# Altium schematic sheet SC942C_ETOR2.SchDoc: Entrées TOR 2/2
size 393 x 270 mm; CompanyName: Seccom; Address1: 521, rue du capt. François Garbit; Address2: 69440 Mornant; Address3: seccom@seccom.fr; Address4: www.seccom.fr; DocumentNumber: 4; SheetNumber: 4; SheetTotal: 8; PageSetup: Record=PageOptions|CenterHorizontal=True|CenterVertical=True|PrintScale=0.74|XCorrection=1.00|YCorrection=1.00|PrintKind=0|BorderSize=5000000|LeftOffset=0|BottomOffset=0|Orientation=2|PaperLength=1000|PaperWidth=1000|Scale=100|PaperSource=7|PrintQuality=-4|MediaType=1|DitherType=10|PaperKind=A4|PrintScaleMode=1
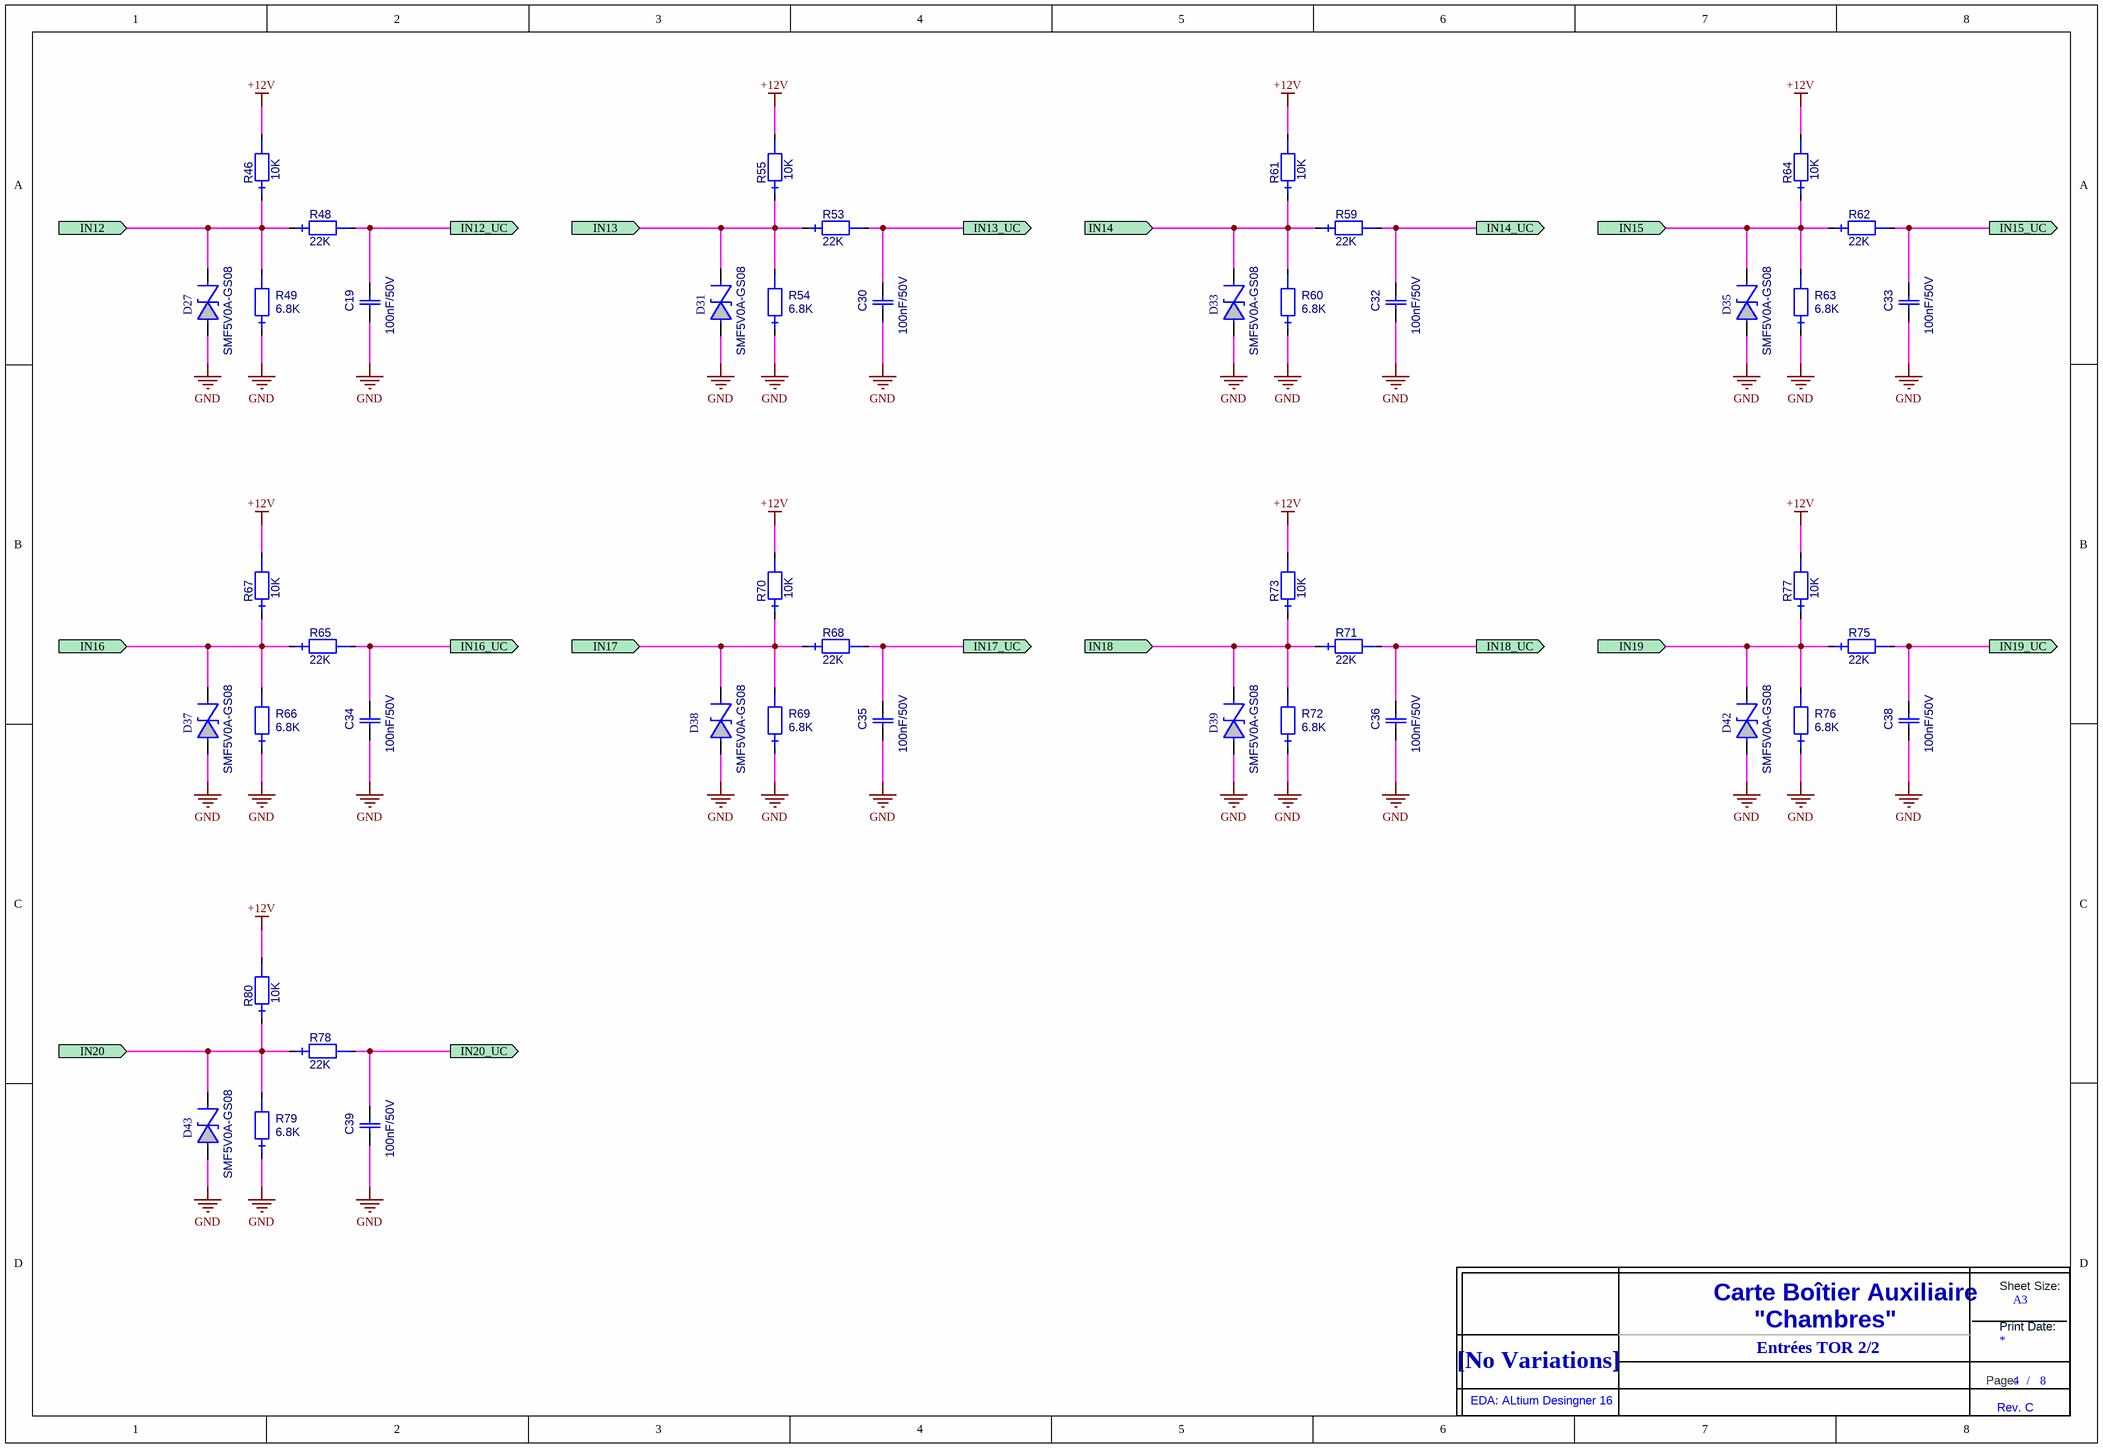
[diagram p0: SC942C_ETOR2.SchDoc]

## Parts
C19  value 100nF/50V  [0805_ReflowSoldering_CAP]  (hidden comment: C_0805_X7R_10%_100N-50V)
C30  value 100nF/50V  [0805_ReflowSoldering_CAP]  (hidden comment: C_0805_X7R_10%_100N-50V)
C32  value 100nF/50V  [0805_ReflowSoldering_CAP]  (hidden comment: C_0805_X7R_10%_100N-50V)
C33  value 100nF/50V  [0805_ReflowSoldering_CAP]  (hidden comment: C_0805_X7R_10%_100N-50V)
C34  value 100nF/50V  [0805_ReflowSoldering_CAP]  (hidden comment: C_0805_X7R_10%_100N-50V)
C35  value 100nF/50V  [0805_ReflowSoldering_CAP]  (hidden comment: C_0805_X7R_10%_100N-50V)
C36  value 100nF/50V  [0805_ReflowSoldering_CAP]  (hidden comment: C_0805_X7R_10%_100N-50V)
C38  value 100nF/50V  [0805_ReflowSoldering_CAP]  (hidden comment: C_0805_X7R_10%_100N-50V)
C39  value 100nF/50V  [0805_ReflowSoldering_CAP]  (hidden comment: C_0805_X7R_10%_100N-50V)
D27  SMF5V0A-GS08  [DO219AB-SMF-P_ReflowSoldering]
D31  SMF5V0A-GS08  [DO219AB-SMF-P_ReflowSoldering]
D33  SMF5V0A-GS08  [DO219AB-SMF-P_ReflowSoldering]
D35  SMF5V0A-GS08  [DO219AB-SMF-P_ReflowSoldering]
D37  SMF5V0A-GS08  [DO219AB-SMF-P_ReflowSoldering]
D38  SMF5V0A-GS08  [DO219AB-SMF-P_ReflowSoldering]
D39  SMF5V0A-GS08  [DO219AB-SMF-P_ReflowSoldering]
D42  SMF5V0A-GS08  [DO219AB-SMF-P_ReflowSoldering]
D43  SMF5V0A-GS08  [DO219AB-SMF-P_ReflowSoldering]
R46  value 10K  [0805_ReflowSoldering_RES]  (hidden comment: RES_0805_1%_100PPM_10K)
R48  value 22K  [0805_ReflowSoldering_RES]  (hidden comment: RES_0805_1%_100PPM_22K)
R49  value 6.8K  [0805_ReflowSoldering_RES]  (hidden comment: RES_0805_1%_100PPM_6.8K)
R53  value 22K  [0805_ReflowSoldering_RES]  (hidden comment: RES_0805_1%_100PPM_22K)
R54  value 6.8K  [0805_ReflowSoldering_RES]  (hidden comment: RES_0805_1%_100PPM_6.8K)
R55  value 10K  [0805_ReflowSoldering_RES]  (hidden comment: RES_0805_1%_100PPM_10K)
R59  value 22K  [0805_ReflowSoldering_RES]  (hidden comment: RES_0805_1%_100PPM_22K)
R60  value 6.8K  [0805_ReflowSoldering_RES]  (hidden comment: RES_0805_1%_100PPM_6.8K)
R61  value 10K  [0805_ReflowSoldering_RES]  (hidden comment: RES_0805_1%_100PPM_10K)
R62  value 22K  [0805_ReflowSoldering_RES]  (hidden comment: RES_0805_1%_100PPM_22K)
R63  value 6.8K  [0805_ReflowSoldering_RES]  (hidden comment: RES_0805_1%_100PPM_6.8K)
R64  value 10K  [0805_ReflowSoldering_RES]  (hidden comment: RES_0805_1%_100PPM_10K)
R65  value 22K  [0805_ReflowSoldering_RES]  (hidden comment: RES_0805_1%_100PPM_22K)
R66  value 6.8K  [0805_ReflowSoldering_RES]  (hidden comment: RES_0805_1%_100PPM_6.8K)
R67  value 10K  [0805_ReflowSoldering_RES]  (hidden comment: RES_0805_1%_100PPM_10K)
R68  value 22K  [0805_ReflowSoldering_RES]  (hidden comment: RES_0805_1%_100PPM_22K)
R69  value 6.8K  [0805_ReflowSoldering_RES]  (hidden comment: RES_0805_1%_100PPM_6.8K)
R70  value 10K  [0805_ReflowSoldering_RES]  (hidden comment: RES_0805_1%_100PPM_10K)
R71  value 22K  [0805_ReflowSoldering_RES]  (hidden comment: RES_0805_1%_100PPM_22K)
R72  value 6.8K  [0805_ReflowSoldering_RES]  (hidden comment: RES_0805_1%_100PPM_6.8K)
R73  value 10K  [0805_ReflowSoldering_RES]  (hidden comment: RES_0805_1%_100PPM_10K)
R75  value 22K  [0805_ReflowSoldering_RES]  (hidden comment: RES_0805_1%_100PPM_22K)
R76  value 6.8K  [0805_ReflowSoldering_RES]  (hidden comment: RES_0805_1%_100PPM_6.8K)
R77  value 10K  [0805_ReflowSoldering_RES]  (hidden comment: RES_0805_1%_100PPM_10K)
R78  value 22K  [0805_ReflowSoldering_RES]  (hidden comment: RES_0805_1%_100PPM_22K)
R79  value 6.8K  [0805_ReflowSoldering_RES]  (hidden comment: RES_0805_1%_100PPM_6.8K)
R80  value 10K  [0805_ReflowSoldering_RES]  (hidden comment: RES_0805_1%_100PPM_10K)
Title_new?  DNI  (value not drawn)  (graphical)

## Ports
IN12 (in), IN12_UC (out), IN13 (in), IN13_UC (out), IN14 (in), IN14_UC (out), IN15 (in), IN15_UC (out), IN16 (in), IN16_UC (out), IN17 (in), IN17_UC (out), IN18 (in), IN18_UC (out), IN19 (in), IN19_UC (out), IN20 (in), IN20_UC (out)

## Nets
+12V: R46.2 R55.2 R61.2 R64.2 R67.2 R70.2 R73.2 R77.2 R80.2
GND: C19.1 C30.1 C32.1 C33.1 C34.1 C35.1 C36.1 C38.1 C39.1 D27.A D31.A D33.A D35.A D37.A D38.A D39.A D42.A D43.A R49.1 R54.1 R60.1 R63.1 R66.1 R69.1 R72.1 R76.1 R79.1
IN12: D27.K R46.1 R48.1 R49.2 ; port IN12
IN12_UC: C19.2 R48.2 ; port IN12_UC
IN13: D31.K R53.1 R54.2 R55.1 ; port IN13
IN13_UC: C30.2 R53.2 ; port IN13_UC
IN14: D33.K R59.1 R60.2 R61.1 ; port IN14
IN14_UC: C32.2 R59.2 ; port IN14_UC
IN15: D35.K R62.1 R63.2 R64.1 ; port IN15
IN15_UC: C33.2 R62.2 ; port IN15_UC
IN16: D37.K R65.1 R66.2 R67.1 ; port IN16
IN16_UC: C34.2 R65.2 ; port IN16_UC
IN17: D38.K R68.1 R69.2 R70.1 ; port IN17
IN17_UC: C35.2 R68.2 ; port IN17_UC
IN18: D39.K R71.1 R72.2 R73.1 ; port IN18
IN18_UC: C36.2 R71.2 ; port IN18_UC
IN19: D42.K R75.1 R76.2 R77.1 ; port IN19
IN19_UC: C38.2 R75.2 ; port IN19_UC
IN20: D43.K R78.1 R79.2 R80.1 ; port IN20
IN20_UC: C39.2 R78.2 ; port IN20_UC

## Notes on the sheet
- Entrées TOR 2/2
- (in symbol Title_new_1) Sheet Size:; Carte Boîtier Auxiliaire; A3; "Chambres"; Print Date:; [No Variations]; Page:; /; EDA: ALtium Desingner 16; Rev. C

## Library data of the parts
C19 C30 C32-C36 C38 C39 = C_0805_X7R_10%_100N-50V: Condensateur céramique, X7R, 10%, CMS 0805; Creation: LJ; Verification: LJ (28/05/04); Reference: 000042/00; Boitier: 0805; Remarque: {Remarque}; Fabricant: AVX; Ref Fab: 08055C104KAT2A; Coeff: 1; ComponentLink1URL: o:\_Documentation\Datasheets\BC_Components\Condo_CMS_NPO-X7R-Y5V.pdf; ComponentLink2URL: o:\_Documentation\Datasheets\_BOITIERS\PASSIF_CMS\RC_0805_(2x1,25)_(Schneider).PDF; Config: *; ComponentLink1Description: Datasheet; ComponentLink2Description: Datasheet Boitier; Supplier 1: Farnell; Supplier Part Number 1: 499687
D27 D31 D33 D35 D37-D39 D42 D43 = SMF5V0A-GS08: Diode Transil/TVS unidirectionnelle (A), 200W, 5V, CMS; Creation: LJ; Boitier: DO219AB/SMF; Remarque: {Remarque}; Fabricant: Vishay; Coeff: 1; Verification: *; Ref Fab: SMF5V0A-GS08; ComponentLink1URL: o:\_Documentation\Datasheets\Vishay\SMF5V0A~51A.pdf; ComponentLink2URL: o:\_Documentation\Datasheets\_BOITIERS\; Config: *; ComponentLink1Description: Datasheet; ComponentLink2Description: Datasheet Boitier; Value: SMF5V0A-GS08; Supplier 1: Farnell; Supplier 2: Mouser; Supplier Part Number 1: 1617696; Supplier Part Number 2: 78-SMF5V0A
R46 R55 R61 R64 R67 R70 R73 R77 R80 = RES_0805_1%_100PPM_10K: Résistance CMS 0805, 0.125W, 1%, 100ppm, 150V; Creation: LJ (06/02/09); Reference: 000063/00; Boitier: 0805; Remarque: {Remarque}; Fabricant: Yageo; Ref Fab: RC0805FR-0710KL; Coeff: 1; Verification: *; ComponentLink1URL: o:\_Documentation\Datasheets\BC_Components\Resistances_ThickFilmFlatChip_0402-0603-0805-1206.pdf; ComponentLink2URL: o:\_Documentation\Datasheets\_BOITIERS\PASSIF_CMS\RC_0805_(2x1,25)_(Schneider).PDF; Config: *; ComponentLink1Description: Datasheet; ComponentLink2Description: Datasheet Boitier; Supplier 1: Farnell; Supplier Part Number 1: 9237755
R48 R53 R59 R62 R65 R68 R71 R75 R78 = RES_0805_1%_100PPM_22K: Résistance CMS 0805, 0.125W, 1%, 100ppm, 150V; Creation: LJ (06/02/09); Reference: 000137/00; Boitier: 0805; Remarque: {Remarque}; Fabricant: Yageo; Ref Fab: RC0805FR-0722KL; Coeff: 1; Verification: *; ComponentLink1URL: o:\_Documentation\Datasheets\BC_Components\Resistances_ThickFilmFlatChip_0402-0603-0805-1206.pdf; ComponentLink2URL: o:\_Documentation\Datasheets\_BOITIERS\PASSIF_CMS\RC_0805_(2x1,25)_(Schneider).PDF; Config: *; ComponentLink1Description: Datasheet; ComponentLink2Description: Datasheet Boitier; Supplier 1: Farnell; Supplier Part Number 1: 9237798; Supplier 2: Mouser; Supplier Part Number 2: 603-RC0805FR-0722KL
R49 R54 R60 R63 R66 R69 R72 R76 R79 = RES_0805_1%_100PPM_6.8K: Résistance CMS 0805, 0.125W, 1%, 100ppm, 150V; Creation: LJ (06/02/09); Reference: 000129/00; Boitier: 0805; Remarque: {Remarque}; Fabricant: Yageo; Ref Fab: RC0805FR-076K8L; Coeff: 1; Verification: *; ComponentLink1URL: o:\_Documentation\Datasheets\BC_Components\Resistances_ThickFilmFlatChip_0402-0603-0805-1206.pdf; ComponentLink2URL: o:\_Documentation\Datasheets\_BOITIERS\PASSIF_CMS\RC_0805_(2x1,25)_(Schneider).PDF; Config: *; ComponentLink1Description: Datasheet; ComponentLink2Description: Datasheet Boitier; Supplier 1: Farnell; Supplier Part Number 1: 9237739; Supplier 2: Mouser; Supplier Part Number 2: 603-RC0805FR-076K8L
Title_new? = Title_new_1